# Altium project CARTE_TEMPO.PrjPcb
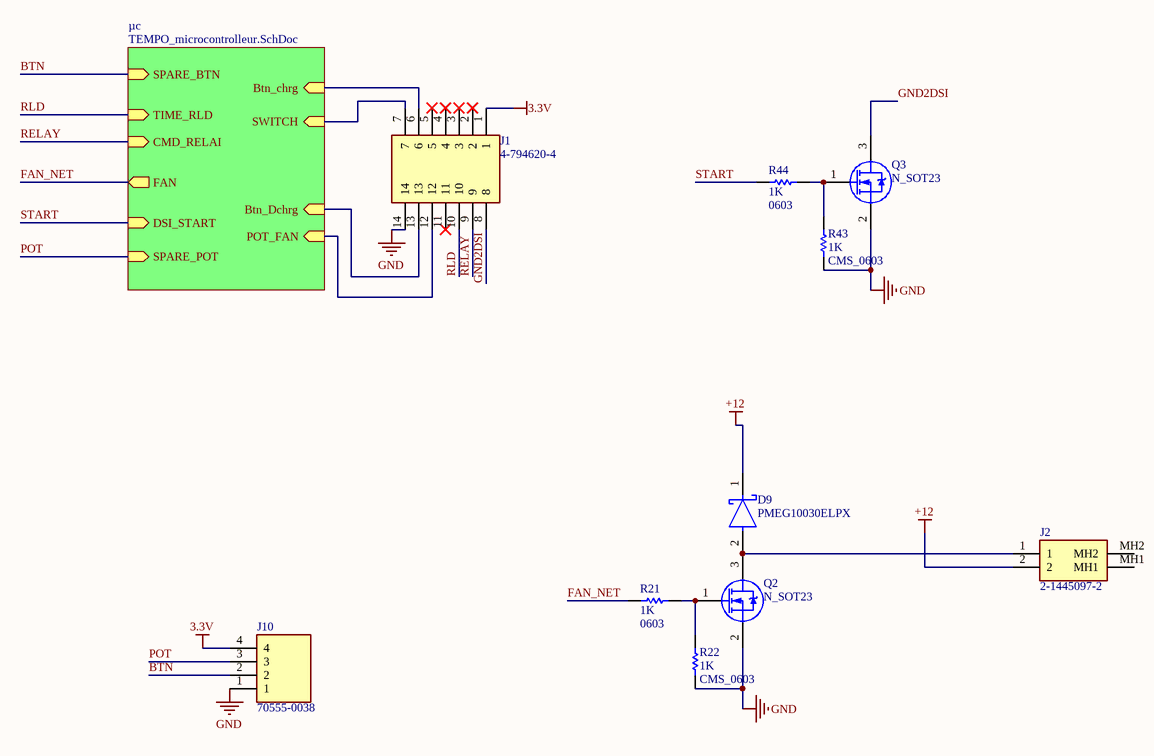
[diagram p0: main.SchDoc]
3 sheets, 94 parts. Net scope: hierarchical (ports join the sheet entries above them; power ports are global).
Board file: AFF169.PcbDoc
Sheets:
  main.SchDoc
    µc = TEMPO_microcontrolleur.SchDoc
      Alimentation = alimentation.SchDoc

## Sheet main.SchDoc
size A4; SheetNumber: 1; SheetTotal: 3

### Parts
D9  PMEG10030ELPX  [FP-SOD128-MFG]
J1  4-794620-4  [4-794620-4]
J2  2-1445097-2  [214450972]
J10  70555-0038  [705550038]
Q2  Package: N_SOT23  [TRANSISTOR_MOSFET-N_SOT23_GSD]  (hidden comment: TRANSISTOR_MOSFET-N_SOT23_GSD)
Q3  Package: N_SOT23  [TRANSISTOR_MOSFET-N_SOT23_GSD]  (hidden comment: TRANSISTOR_MOSFET-N_SOT23_GSD)
R21  value 1K  Type: 0603  [RESISTANCE_CMS_0603]  (hidden comment: RESISTANCE_CMS_0603)
R22  value 1K  Type: CMS_0603  [RESISTANCE_CMS_0603]  (hidden comment: RESISTANCE_CMS_0603)
R43  value 1K  Type: CMS_0603  [RESISTANCE_CMS_0603]  (hidden comment: RESISTANCE_CMS_0603)
R44  value 1K  Type: 0603  [RESISTANCE_CMS_0603]  (hidden comment: RESISTANCE_CMS_0603)

### Sub-sheets
µc = TEMPO_microcontrolleur.SchDoc: Btn_Dchrg (in), Btn_chrg (in), SWITCH (in), FAN (out), POT_FAN (in), CMD_RELAI (in), DSI_START (in), TIME_RLD (in), SPARE_POT (in), SPARE_BTN (in)

### Nets
3.3V: J1.1 J10.4
+12: D9.1(K) J2.2
GND: J1.14 J10.1 Q2.2(S) Q3.2(S) R22.2 R43.2
BTN: J10.2 ; sheet µc/SPARE_BTN
FAN_NET: R21.2 ; sheet µc/FAN
GND2DSI: J1.8 Q3.3(D)
POT: J10.3 ; sheet µc/SPARE_POT
RELAY: J1.9 ; sheet µc/CMD_RELAI
RLD: J1.10 ; sheet µc/TIME_RLD
START: R44.2 ; sheet µc/DSI_START
NetC10_2: J1.7 ; sheet µc/SWITCH
NetC11_2: J1.13 ; sheet µc/Btn_Dchrg
NetC12_2: J1.6 ; sheet µc/Btn_chrg
NetD9_2: D9.2(A) J2.1 Q2.3(D)
NetJ1_12: J1.12 ; sheet µc/POT_FAN
NetQ2_1: Q2.1(G) R21.1 R22.1
NetQ3_1: Q3.1(G) R43.1 R44.1

Not connected (* = marked no-connect by the designer): J1 2* 3* 4* 5* 11*; J2 MH1 MH2

### Library data of the parts
D9 = CMP-14398-000022-1: DIODE SCHOTTKY 100V 3A SOD128
J1 = 4-794620-4: Connector; Manufacturer_Name: TE Connectivity; Datasheet Link: https://www.te.com/commerce/DocumentDelivery/DDEController?Action=srchrtrv&DocNm=1773458-4_MICRO_MATE_N_LOK&DocType=Data+Sheet&DocLang=English&PartCntxt=4-794620-4&DocFormat=pdf; Manufacturer_Part_Number: 4-794620-4; Mouser Part Number: 571-4-794620-4; Mouser Price/Stock: https://www.mouser.com/Search/Refine.aspx?Keyword=571-4-794620-4; Arrow Part Number: 4-794620-4; Arrow Price/Stock: https://www.arrow.com/en/products/4-794620-4/te-connectivity?region=nac
J2 = 2-1445097-2: MICRO MNL HDR ASSY S/ROW AU LF; Manufacturer_Name: TE Connectivity; Geometry.Height: 5.8mm; Mouser Part Number: 571-2-1445097-2; Mouser Price/Stock: https://www.mouser.co.uk/ProductDetail/TE-Connectivity-AMP/2-1445097-2?qs=WeHYKPpr%2FZjBFQqBJ1Kj7A%3D%3D; Manufacturer_Part_Number: 2-1445097-2; Datasheet Link: https://www.te.com/commerce/DocumentDelivery/DDEController?Action=showdoc&DocId=Customer+Drawing%7F1445097%7FA2%7Fpdf%7FEnglish%7FENG_CD_1445097_A2.pdf%7F2-1445097-2
J10 = 70555-0038: Connector; Manufacturer_Name: Molex; Allied_Number: 70091307; Datasheet Link: http://uk.rs-online.com/web/p/products/7978792P; Height: 7.25mm; RS Part Number: 7978792P; RS Price/Stock: http://uk.rs-online.com/web/p/products/7978792P; Manufacturer_Part_Number: 70555-0038
Q2 Q3 = TRANSISTOR_MOSFET-N_SOT23_GSD: TRANSISTOR MOSFET CANAL N BOITIER SOT23_GSD
R21 R22 R43 R44 = RESISTANCE_CMS_0603: RESISTANCE CMS 0603

## Sheet TEMPO_microcontrolleur.SchDoc: OUAIS
size A3; ApprovedBy: WATTEU; Author: watteu; DrawnBy: WATTEU; SheetNumber: 2; SheetTotal: 3
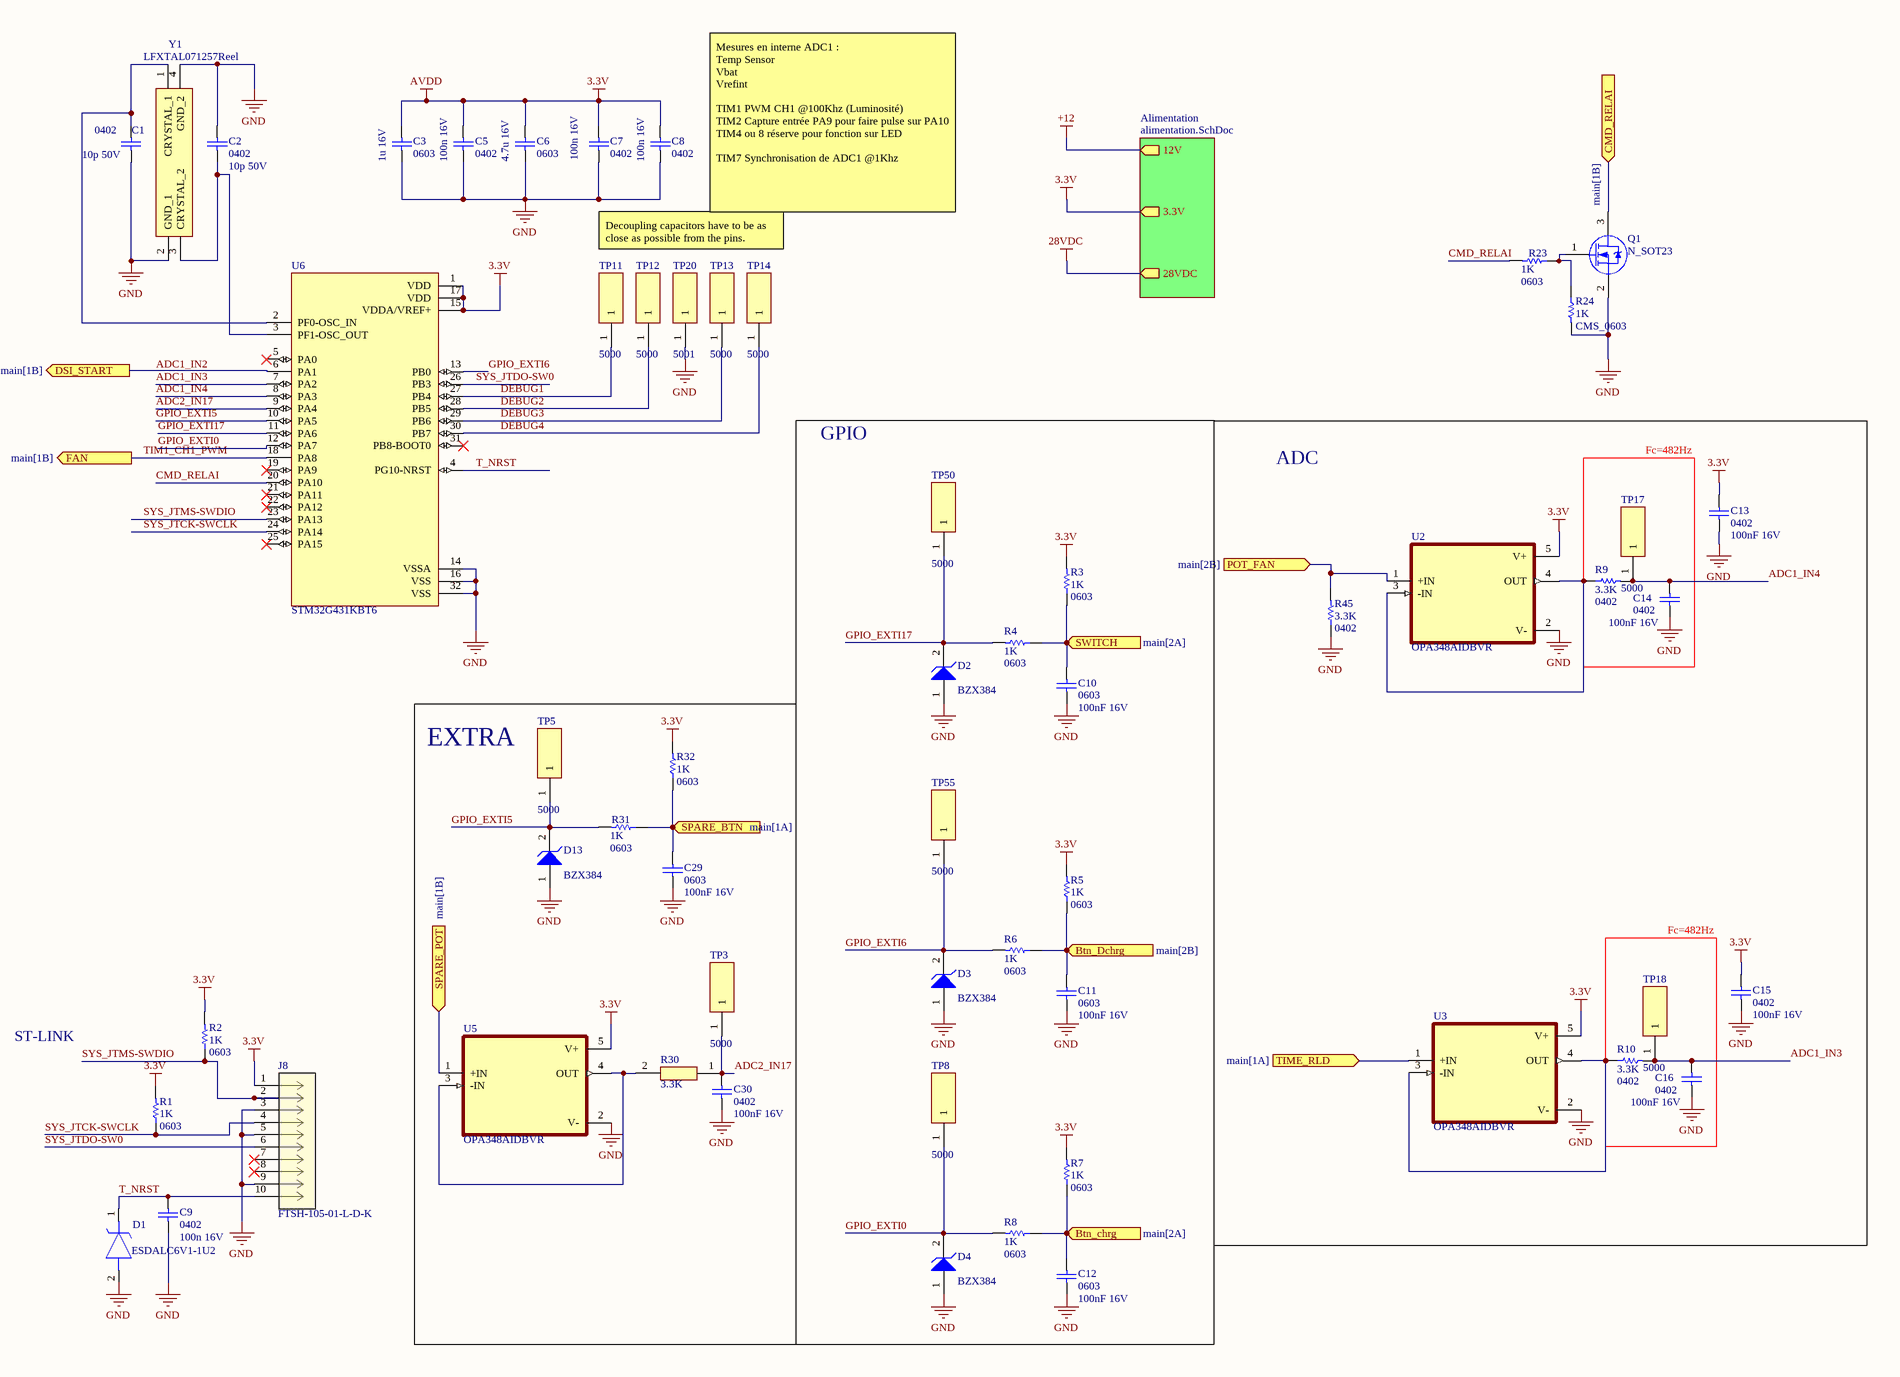
[diagram p1: TEMPO_microcontrolleur.SchDoc, right]

### Parts
C1  value 10p 50V  Type: 0402  [CONDENSATEUR_CMS_0402]  (hidden comment: CMS_0402)
C2  value 10p 50V  Type: 0402  [CONDENSATEUR_CMS_0402]  (hidden comment: CMS_0402)
C3  value 1u 16V  Type: 0603  [CONDENSATEUR_CMS_0603]  (hidden comment: CMS_0603)
C5  value 100n 16V  Type: 0402  [CONDENSATEUR_CMS_0402]  (hidden comment: CMS_0402)
C6  value 4.7u 16V  Type: 0603  [CONDENSATEUR_CMS_0603]  (hidden comment: CMS_0603)
C7  value 100n 16V  Type: 0402  [CONDENSATEUR_CMS_0402]  (hidden comment: CMS_0402)
C8  value 100n 16V  Type: 0402  [CONDENSATEUR_CMS_0402]  (hidden comment: CMS_0402)
C9  value 100n 16V  Type: 0402  [CONDENSATEUR_CMS_0402]  (hidden comment: CMS_0402)
C10  value 100nF 16V  Type: 0603  [CONDENSATEUR_CMS_0603]  (hidden comment: CMS_0603)
C11  value 100nF 16V  Type: 0603  [CONDENSATEUR_CMS_0603]  (hidden comment: CMS_0603)
C12  value 100nF 16V  Type: 0603  [CONDENSATEUR_CMS_0603]  (hidden comment: CMS_0603)
C13  value 100nF 16V  Type: 0402  [CONDENSATEUR_CMS_0402]  (hidden comment: CMS_0402)
C14  value 100nF 16V  Type: 0402  [CONDENSATEUR_CMS_0402]  (hidden comment: CMS_0402)
C15  value 100nF 16V  Type: 0402  [CONDENSATEUR_CMS_0402]  (hidden comment: CMS_0402)
C16  value 100nF 16V  Type: 0402  [CONDENSATEUR_CMS_0402]  (hidden comment: CMS_0402)
C29  value 100nF 16V  Type: 0603  [CONDENSATEUR_CMS_0603]  (hidden comment: CMS_0603)
C30  value 100nF 16V  Type: 0402  [CONDENSATEUR_CMS_0402]  (hidden comment: CMS_0402)
D1  ESDALC6V1-1U2  [PZU68B1AQX]
D2  Type: BZX384  [DIODE_CMS_SOD323]  (hidden comment: DIODE_CMS_ZENER_SOD323 : BZX384)
D3  Type: BZX384  [DIODE_CMS_SOD323]  (hidden comment: DIODE_CMS_ZENER_SOD323 : BZX384)
D4  Type: BZX384  [DIODE_CMS_SOD323]  (hidden comment: DIODE_CMS_ZENER_SOD323 : BZX384)
D13  Type: BZX384  [DIODE_CMS_SOD323]  (hidden comment: DIODE_CMS_ZENER_SOD323 : BZX384)
J8  FTSH-105-01-L-D-K  [CONN_FTSH-105-01-L-D-K_SAI]
Q1  Package: N_SOT23  [TRANSISTOR_MOSFET-N_SOT23_GSD]  (hidden comment: TRANSISTOR_MOSFET-N_SOT23_GSD)
R1  value 1K  Type: 0603  [RESISTANCE_CMS_0603]  (hidden comment: RESISTANCE_CMS_0603)
R2  value 1K  Type: 0603  [RESISTANCE_CMS_0603]  (hidden comment: RESISTANCE_CMS_0603)
R3  value 1K  Type: 0603  [RESISTANCE_CMS_0603]  (hidden comment: RESISTANCE_CMS_0603)
R4  value 1K  Type: 0603  [RESISTANCE_CMS_0603]  (hidden comment: RESISTANCE_CMS_0603)
R5  value 1K  Type: 0603  [RESISTANCE_CMS_0603]  (hidden comment: RESISTANCE_CMS_0603)
R6  value 1K  Type: 0603  [RESISTANCE_CMS_0603]  (hidden comment: RESISTANCE_CMS_0603)
R7  value 1K  Type: 0603  [RESISTANCE_CMS_0603]  (hidden comment: RESISTANCE_CMS_0603)
R8  value 1K  Type: 0603  [RESISTANCE_CMS_0603]  (hidden comment: RESISTANCE_CMS_0603)
R9  value 3.3K  Type: 0402  [RESISTANCE_CMS_0805]  (hidden comment: RESISTANCE_CMS_0805)
R10  value 3.3K  Type: 0402  [RESISTANCE_CMS_0805]  (hidden comment: RESISTANCE_CMS_0805)
R23  value 1K  Type: 0603  [RESISTANCE_CMS_0603]  (hidden comment: RESISTANCE_CMS_0603)
R24  value 1K  Type: CMS_0603  [RESISTANCE_CMS_0603]  (hidden comment: RESISTANCE_CMS_0603)
R30  3.3K  [RESC1005X40N]
R31  value 1K  Type: 0603  [RESISTANCE_CMS_0603]  (hidden comment: RESISTANCE_CMS_0603)
R32  value 1K  Type: 0603  [RESISTANCE_CMS_0603]  (hidden comment: RESISTANCE_CMS_0603)
R45  value 3.3K  Type: 0402  [RESISTANCE_CMS_0805]  (hidden comment: RESISTANCE_CMS_0805)
TP3  5000  [5000]
TP5  5000  [5000]
TP8  5000  [5000]
TP11  5000  [5000]
TP12  5000  [5000]
TP13  5000  [5000]
TP14  5000  [5000]
TP17  5000  [5000]
TP18  5000  [5000]
TP20  5001  [5000]
TP50  5000  [5000]
TP55  5000  [5000]
U2  OPA348AIDBVR  [SOT95P280X145-5N]
U3  OPA348AIDBVR  [SOT95P280X145-5N]
U5  OPA348AIDBVR  [SOT95P280X145-5N]
U6  STM32G431KBT6  [QFP80P900X900X160-32N]
Y1  LFXTAL071257Reel  [LFXTAL071257Reel]

### Blocks framed on the sheet
Fc=482Hz: C14 R9 TP17
Fc=482Hz: C16 R10 TP18

### Sub-sheets
Alimentation = alimentation.SchDoc: 12V (out), 3.3V (out), 28VDC (out)

### Ports
Btn_chrg (in, see main[2A]), Btn_Dchrg (in, see main[2B]), CMD_RELAI (in, see main[1B]), DSI_START (out, see main[1B]), FAN (out, see main[1B]), POT_FAN (in, see main[2B]), SPARE_BTN (in, see main[1A]), SPARE_POT (in, see main[1B]), SWITCH (in, see main[2A]), TIME_RLD (in, see main[1A])

### Nets
3.3V: C3.2 C5.2 C6.2 C7.2 C8.2 C13.2 C15.2 J8.1 R1.2 R2.2 R3.2 R5.2 R7.2 R32.2 U2.5(V+) U3.5(V+) U5.5(V+) U6.1(VDD) U6.15(VDDA/VREF+) U6.17(VDD) ; sheet Alimentation/3.3V  [also labelled AVDD]
GND: C1.1 C2.2 C3.1 C5.1 C6.1 C7.1 C8.1 C9.1 C10.1 C11.1 C12.1 C13.1 C14.1 C15.1 C16.1 C29.1 C30.1 D1.2(A) D2.1 D3.1 D4.1 D13.1 J8.3 J8.5 J8.9 Q1.2(S) R24.2 R45.1 TP20.1 U2.2(V-) U3.2(V-) U5.2(V-) U6.14(VSSA) U6.16(VSS) U6.32(VSS) Y1.2(GND_1) Y1.4(GND_2)
ADC1_IN3: C16.2 R10.2 TP18.1 U6.7(PA2)
ADC1_IN4: C14.2 R9.2 TP17.1 U6.8(PA3)
ADC2_IN17: C30.2 R30.1 TP3.1 U6.9(PA4)
BTN: C29.2 R31.1 R32.1 ; port SPARE_BTN
CMD_RELAI: R23.2 U6.20(PA10)
DEBUG1: TP11.1 U6.27(PB4)
DEBUG2: TP12.1 U6.28(PB5)
DEBUG3: TP13.1 U6.29(PB6)
DEBUG4: TP14.1 U6.30(PB7)
GPIO_EXTI0: D4.2 R8.2 TP8.1 U6.12(PA7)
GPIO_EXTI5: D13.2 R31.2 TP5.1 U6.10(PA5)
GPIO_EXTI6: D3.2 R6.2 TP55.1 U6.13(PB0)
GPIO_EXTI17: D2.2 R4.2 TP50.1 U6.11(PA6)
POT: U5.1(+IN) ; port SPARE_POT
RELAY: Q1.3(D) ; port CMD_RELAI
RLD: U3.1(+IN) ; port TIME_RLD
START: U6.6(PA1) ; port DSI_START
SYS_JTCK-SWCLK: J8.4 R1.1 U6.24(PA14)
SYS_JTDO-SW0: J8.6 U6.26(PB3)
SYS_JTMS-SWDIO: J8.2 R2.1 U6.23(PA13)
T_NRST: C9.2 D1.1(K) J8.10 U6.4(PG10-NRST)
TIM1_CH1_PWM: U6.18(PA8) ; port FAN  [project net FAN_NET]
NetC1_2: C1.2 U6.2(PF0-OSC_IN) Y1.1(CRYSTAL_1)
NetC2_1: C2.1 U6.3(PF1-OSC_OUT) Y1.3(CRYSTAL_2)
NetC10_2: C10.2 R3.1 R4.1 ; port SWITCH
NetC11_2: C11.2 R5.1 R6.1 ; port Btn_Dchrg
NetC12_2: C12.2 R7.1 R8.1 ; port Btn_chrg
NetJ1_12: R45.2 U2.1(+IN) ; port POT_FAN
NetQ1_1: Q1.1(G) R23.1 R24.1
NetR9_1: R9.1 U2.3(-IN) U2.4(OUT)
NetR10_1: R10.1 U3.3(-IN) U3.4(OUT)
NetR30_2: R30.2 U5.3(-IN) U5.4(OUT)

Not connected (* = marked no-connect by the designer): J8 7* 8*; U6 5(PA0)* 19(PA9)* 21(PA11)* 22(PA12)* 25(PA15)* 31(PB8-BOOT0)*

### Notes on the sheet
- Mesures en interne ADC1 :
  Temp Sensor
  Vbat
  Vrefint
  TIM1 PWM CH1 @100Khz (Luminosité)
  TIM2 Capture entrée PA9 pour faire pulse sur PA10
  TIM4 ou 8 réserve pour fonction sur LED
  TIM7 Synchronisation de ADC1 @1Khz
- Decoupling capacitors have to be as close as possible from the pins.
- GPIO
- ADC
- EXTRA
- ST-LINK
- Labels drawn without touching a wire or pin: ADC1_IN2

### Library data of the parts
C1 C2 C5 C7-C9 C13-C16 C30 = CONDENSATEUR_CMS_CER_0402: CONDENSATEUR CMS CERAMIQUE 0402
C3 C6 C10-C12 C29 = CONDENSATEUR_CMS_CER_0603: CONDENSATEUR CMS CERAMIQUE 0603
D1 = PZU6.8B1A-QX: Zener Diode; Manufacturer_Name: Nexperia; Datasheet Link: https://assets.nexperia.com/documents/data-sheet/PZUXBA-Q_SER.pdf; Height: 1.1mm; Manufacturer_Part_Number: PZU6.8B1A-QX
J8 = FTSH-105-01-L-D-K: No Description Available; Mfr_Name: Samtec Inc; Digi-Key_Part_Number_1: SAM8798-ND; RefDes: RefDes; Type: Type
Q1 = TRANSISTOR_MOSFET-N_SOT23_GSD: as Q2 on sheet main
R1-R8 R23 R24 R31 R32 = RESISTANCE_CMS_0603: RESISTANCE CMS 0603
R9 R10 R45 = RESISTANCE_CMS_0805: RESISTANCE CMS 0805
R30 = CRCW04020000Z0ED: Resistor; Manufacturer_Name: Vishay; Allied_Number: 70202079; Datasheet Link: http://uk.rs-online.com/web/p/products/2508364793; Height: 0.4mm; RS Part Number: 2508364793; RS Price/Stock: http://uk.rs-online.com/web/p/products/2508364793; Manufacturer_Part_Number: CRCW04020000Z0ED
TP3 TP5 TP8 TP11-TP14 TP17 TP18 TP20 TP50 TP55 = 5000: Connector; Manufacturer_Name: Keystone Electronics; Datasheet Link: http://www.keyelco.com/product-pdf.cfm?p=1309; Manufacturer_Part_Number: 5000; Mouser Part Number: 534-5000; Mouser Price/Stock: https://www.mouser.co.uk/ProductDetail/Keystone-Electronics/5000?qs=q0tsjPZWdm%252B9SiiTAbEwUw%3D%3D; Arrow Part Number: 5000; Arrow Price/Stock: https://www.arrow.com/en/products/5000/keystone-electronics?region=europe
U2 U3 U5 = OPA348AIDBVR: 1MHz, 45uA, RRIO, Single Op Amp 5-SOT-23 -40 to 125; MF: Texas Instruments; Package: SOT-23-5 Texas Instruments; Value: *; MP: OPA348AIDBVR; Texas_Instruments-Purchase-URL: https://snapeda.com/shop?store=Texas+Instruments&id=560751; DigiKey-Purchase-URL: https://snapeda.com/shop?store=DigiKey&id=560751; Arrow_Electronics-Purchase-URL: https://snapeda.com/shop?store=Arrow+Electronics&id=560751; Mouser-Purchase-URL: https://snapeda.com/shop?store=Mouser&id=560751; Digi-Key_Part_Number: 296-26277-1-ND; SnapEDA_Link: https://www.snapeda.com/parts/OPA348AIDBVR/Texas%20Instruments/view-part/560751/?ref=snap
U6 = STM32G431KBT6: ARMÂ® CortexÂ®-M4F STM32G4 Microcontroller IC 32-Bit 170MHz 128KB _128K x 8_ FLASH 32-LQFP _7x7_; MF: STMicroelectronics; Price: None; SnapEDA_Link: https://www.snapeda.com/parts/STM32G431KBT6/STMicroelectronics/view-part/4422336/?ref=snap; MP: STM32G431KBT6; Availability: Unavailable; Value: *; Package: LQFP-32 STMicroelectronics
Y1 = LFXTAL071257Reel: Crystal or Oscillator; Manufacturer_Name: IQD; Datasheet Link: https://www.iqdfrequencyproducts.com/products/pn/LFXTAL071257Reel.pdf; Height: 0.5mm; Manufacturer_Part_Number: LFXTAL071257Reel; Mouser Part Number: 449-LFXTAL071257REEL; Mouser Price/Stock: https://www.mouser.co.uk/ProductDetail/IQD/LFXTAL071257Reel?qs=nFovR%252B4R4UNJEiCmxCmq2g%3D%3D

## Sheet alimentation.SchDoc
size A4; DrawnBy: WATTEU; SheetNumber: 3; SheetTotal: 3
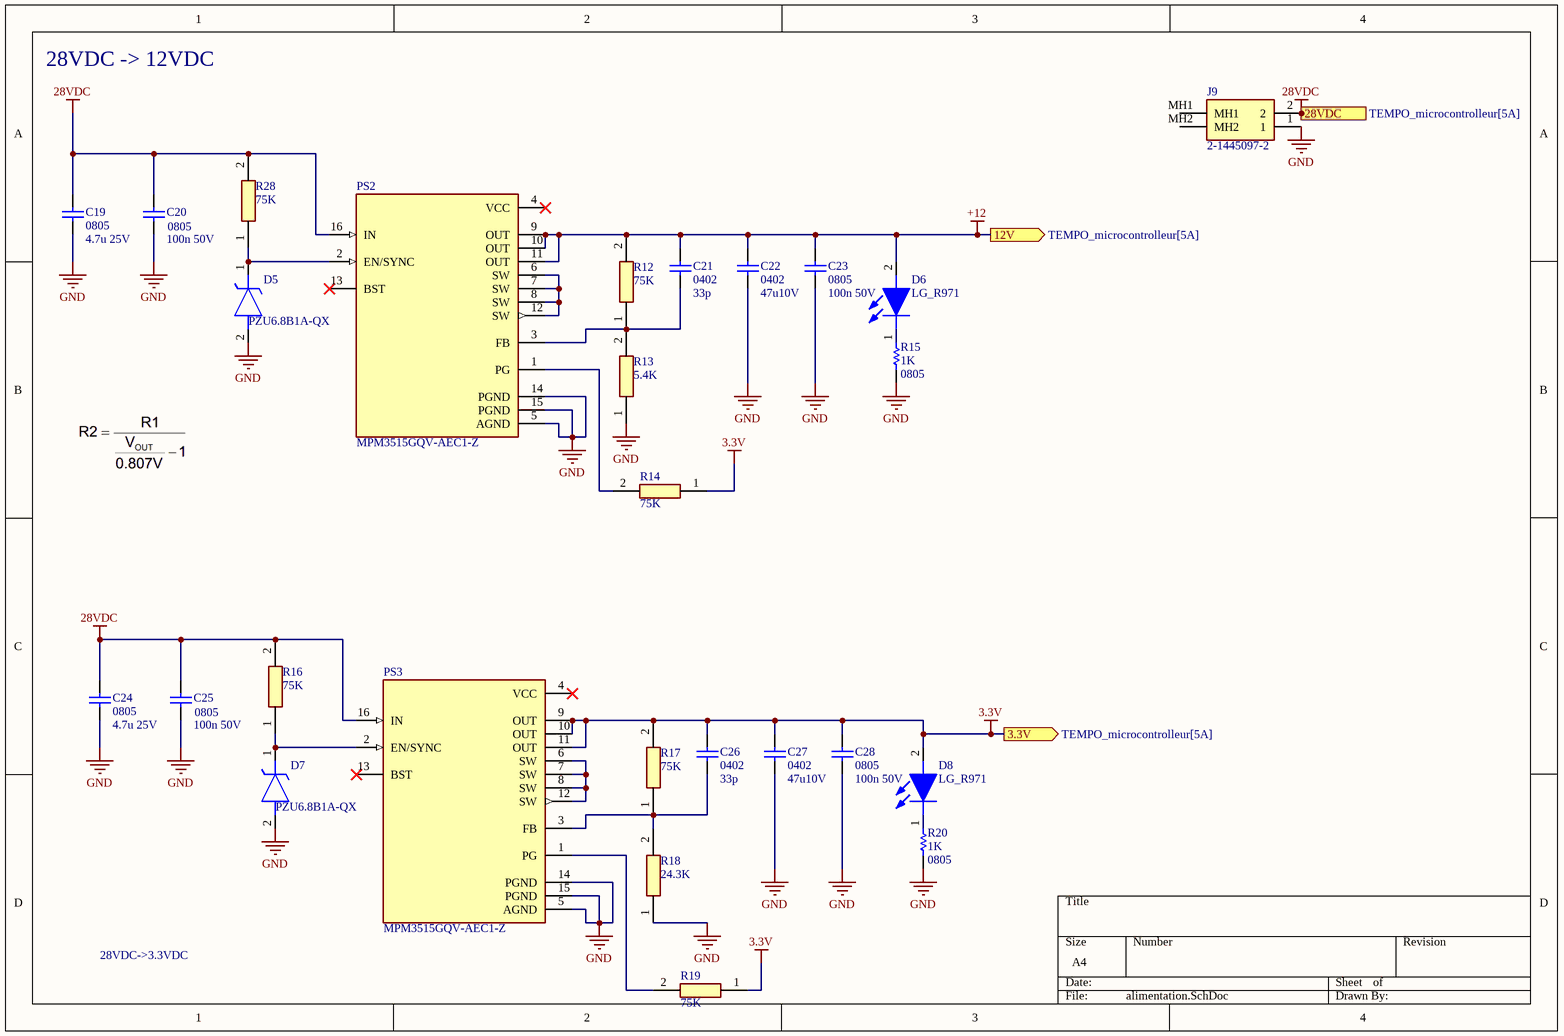
[diagram p2: alimentation.SchDoc]

### Parts
C19  value 4.7u 25V  Type: 0805  [CONDENSATEUR_CMS_0805]  (hidden comment: CMS_0805)
C20  value 100n 50V  Type: 0805  [CONDENSATEUR_CMS_0805]  (hidden comment: CMS_0805)
C21  value 33p  Type: 0402  [CONDENSATEUR_CMS_0402]  (hidden comment: CMS_0402)
C22  value 47u10V  Type: 0402  [CONDENSATEUR_CMS_0402]  (hidden comment: CMS_0402)
C23  value 100n 50V  Type: 0805  [CONDENSATEUR_CMS_0402]  (hidden comment: CMS_0402)
C24  value 4.7u 25V  Type: 0805  [CONDENSATEUR_CMS_0805]  (hidden comment: CMS_0805)
C25  value 100n 50V  Type: 0805  [CONDENSATEUR_CMS_0805]  (hidden comment: CMS_0805)
C26  value 33p  Type: 0402  [CONDENSATEUR_CMS_0402]  (hidden comment: CMS_0402)
C27  value 47u10V  Type: 0402  [CONDENSATEUR_CMS_0402]  (hidden comment: CMS_0402)
C28  value 100n 50V  Type: 0805  [CONDENSATEUR_CMS_0402]  (hidden comment: CMS_0402)
D5  PZU6.8B1A-QX  [PZU68B1AQX]
D6  LG_R971  [LEDC2012X90N]
D7  PZU6.8B1A-QX  [PZU68B1AQX]
D8  LG_R971  [LEDC2012X90N]
J9  2-1445097-2  [214450972]
PS2  MPM3515GQV-AEC1-Z  [CONV_MPM3515GQV-AEC1-Z]
PS3  MPM3515GQV-AEC1-Z  [CONV_MPM3515GQV-AEC1-Z]
R12  75K  [RESC1005X40N]
R13  5.4K  [RESC1005X40N]
R14  75K  [RESC1005X40N]
R15  value 1K  Type: 0805  [RESISTANCE_CMS_0603]  (hidden comment: RESISTANCE_CMS_0603)
R16  75K  [RESC1005X40N]
R17  75K  [RESC1005X40N]
R18  24.3K  [RESC1005X40N]
R19  75K  [RESC1005X40N]
R20  value 1K  Type: 0805  [RESISTANCE_CMS_0603]  (hidden comment: RESISTANCE_CMS_0603)
R28  75K  [RESC1005X40N]

### Ports
3.3V (out, see TEMPO_microcontrolleur[5A]), 12V (out, see TEMPO_microcontrolleur[5A]), 28VDC (out, see TEMPO_microcontrolleur[5A])

### Nets
3.3V: C26.1 C27.1 C28.1 D8.2(A) PS3.9(OUT) PS3.10(OUT) PS3.11(OUT) R14.1 R17.2 R19.1 ; port 3.3V
28VDC: C19.2 C20.2 C24.2 C25.2 J9.2 PS2.16(IN) PS3.16(IN) R16.2 R28.2 ; port 28VDC
+12: C21.1 C22.1 C23.1 D6.2(A) PS2.9(OUT) PS2.10(OUT) PS2.11(OUT) R12.2 ; port 12V
GND: C19.1 C20.1 C22.2 C23.2 C24.1 C25.1 C27.2 C28.2 D5.2(A) D7.2(A) J9.1 PS2.5(AGND) PS2.14(PGND) PS2.15(PGND) PS3.5(AGND) PS3.14(PGND) PS3.15(PGND) R13.1 R15.1 R18.1 R20.1
NetC21_2: C21.2 PS2.3(FB) R12.1 R13.2
NetC26_2: C26.2 PS3.3(FB) R17.1 R18.2
NetD5_1: D5.1(K) PS2.2(EN/SYNC) R28.1
NetD6_1: D6.1(K) R15.2
NetD7_1: D7.1(K) PS3.2(EN/SYNC) R16.1
NetD8_1: D8.1(K) R20.2
NetPS2_1: PS2.1(PG) R14.2
NetPS2_6: PS2.6(SW) PS2.7(SW) PS2.8(SW) PS2.12(SW)
NetPS3_1: PS3.1(PG) R19.2
NetPS3_6: PS3.6(SW) PS3.7(SW) PS3.8(SW) PS3.12(SW)

Not connected (* = marked no-connect by the designer): J9 MH1 MH2; PS2 4(VCC)* 13(BST)*; PS3 4(VCC)* 13(BST)*

### Notes on the sheet
- 28VDC -> 12VDC
- 28VDC->3.3VDC

### Library data of the parts
C19 C20 C24 C25 = CONDENSATEUR_CMS_CER_0805: CONDENSATEUR CMS CERAMIQUE 0805
C21-C23 C26-C28 = CONDENSATEUR_CMS_CER_0402: CONDENSATEUR CMS CERAMIQUE 0402
D5 D7 = PZU6.8B1A-QX: Zener Diode; Manufacturer_Name: Nexperia; Datasheet Link: https://assets.nexperia.com/documents/data-sheet/PZUXBA-Q_SER.pdf; Height: 1.1mm; Manufacturer_Part_Number: PZU6.8B1A-QX
D6 D8 = LG_R971: Green 570nm LED Indication - Discrete 2.2V 0805 (2012 Metric); MF: OSRAM Opto; MP: LG R971; Package: 0805 Osram Opto; Price: None; Value: *; SnapEDA_Link: https://www.snapeda.com/parts/LG%20R971/OSRAM+Opto+Semiconductors+Inc./view-part/?ref=snap; Availability: In Stock; Check_prices: https://www.snapeda.com/parts/LG%20R971/OSRAM+Opto+Semiconductors+Inc./view-part/?ref=eda
J9 = 2-1445097-2: as J2 on sheet main; Mouser Part Number: 571-2-1445097-2; Mouser Price/Stock: https://www.mouser.co.uk/ProductDetail/TE-Connectivity-AMP/2-1445097-2?qs=WeHYKPpr%2FZjBFQqBJ1Kj7A%3D%3D; Manufacturer_Part_Number: 2-1445097-2; Datasheet Link: https://www.te.com/commerce/DocumentDelivery/DDEController?Action=showdoc&DocId=Customer+Drawing%7F1445097%7FA2%7Fpdf%7FEnglish%7FENG_CD_1445097_A2.pdf%7F2-1445097-2
PS2 PS3 = MPM3515GQV-AEC1-Z: Non-Isolated PoL Module DC DC Converter 1 Output 0.8 ~ 30V 1.5A 4V - 36V Input; MF: Monolithic Power; MP: MPM3515GQV-AEC1-Z; DigiKey-Purchase-URL: https://snapeda.com/shop?store=DigiKey&id=1050597; Availability: Unavailable; SnapEDA_Link: https://www.snapeda.com/parts/MPM3515GQV-AEC1-Z/Monolithic%20Power%20Systems%20Inc./view-part/1050597/?ref=snap; Package: QFN-17 Monolithic Power Systems; Price: None; Value: *
R12-R14 R16-R19 R28 = CRCW04020000Z0ED: as R30 on sheet TEMPO_microcontrolleur; Datasheet Link: http://uk.rs-online.com/web/p/products/2508364793; Height: 0.4mm; RS Part Number: 2508364793; RS Price/Stock: http://uk.rs-online.com/web/p/products/2508364793; Manufacturer_Part_Number: CRCW04020000Z0ED
R15 R20 = RESISTANCE_CMS_0603: RESISTANCE CMS 0603

## Nets that join several sheets
3.3V: main (J1.1 J10.4), TEMPO_microcontrolleur (20 pins), alimentation (10 pins)
+12: main (D9.1 J2.2), alimentation (8 pins)
GND: main (6 pins), TEMPO_microcontrolleur (37 pins), alimentation (21 pins)
BTN: main (J10.2), TEMPO_microcontrolleur (C29.2 R31.1 R32.1)
FAN_NET: main (R21.2), TEMPO_microcontrolleur (U6.18)
NetC10_2: main (J1.7), TEMPO_microcontrolleur (C10.2 R3.1 R4.1)
NetC11_2: main (J1.13), TEMPO_microcontrolleur (C11.2 R5.1 R6.1)
NetC12_2: main (J1.6), TEMPO_microcontrolleur (C12.2 R7.1 R8.1)
NetJ1_12: main (J1.12), TEMPO_microcontrolleur (R45.2 U2.1)
POT: main (J10.3), TEMPO_microcontrolleur (U5.1)
RELAY: main (J1.9), TEMPO_microcontrolleur (Q1.3)
RLD: main (J1.10), TEMPO_microcontrolleur (U3.1)
START: main (R44.2), TEMPO_microcontrolleur (U6.6)